# Altium schematic sheet Ports and Power.SchDoc
size 420 x 297 mm; SheetNumber: 7; SheetTotal: 7
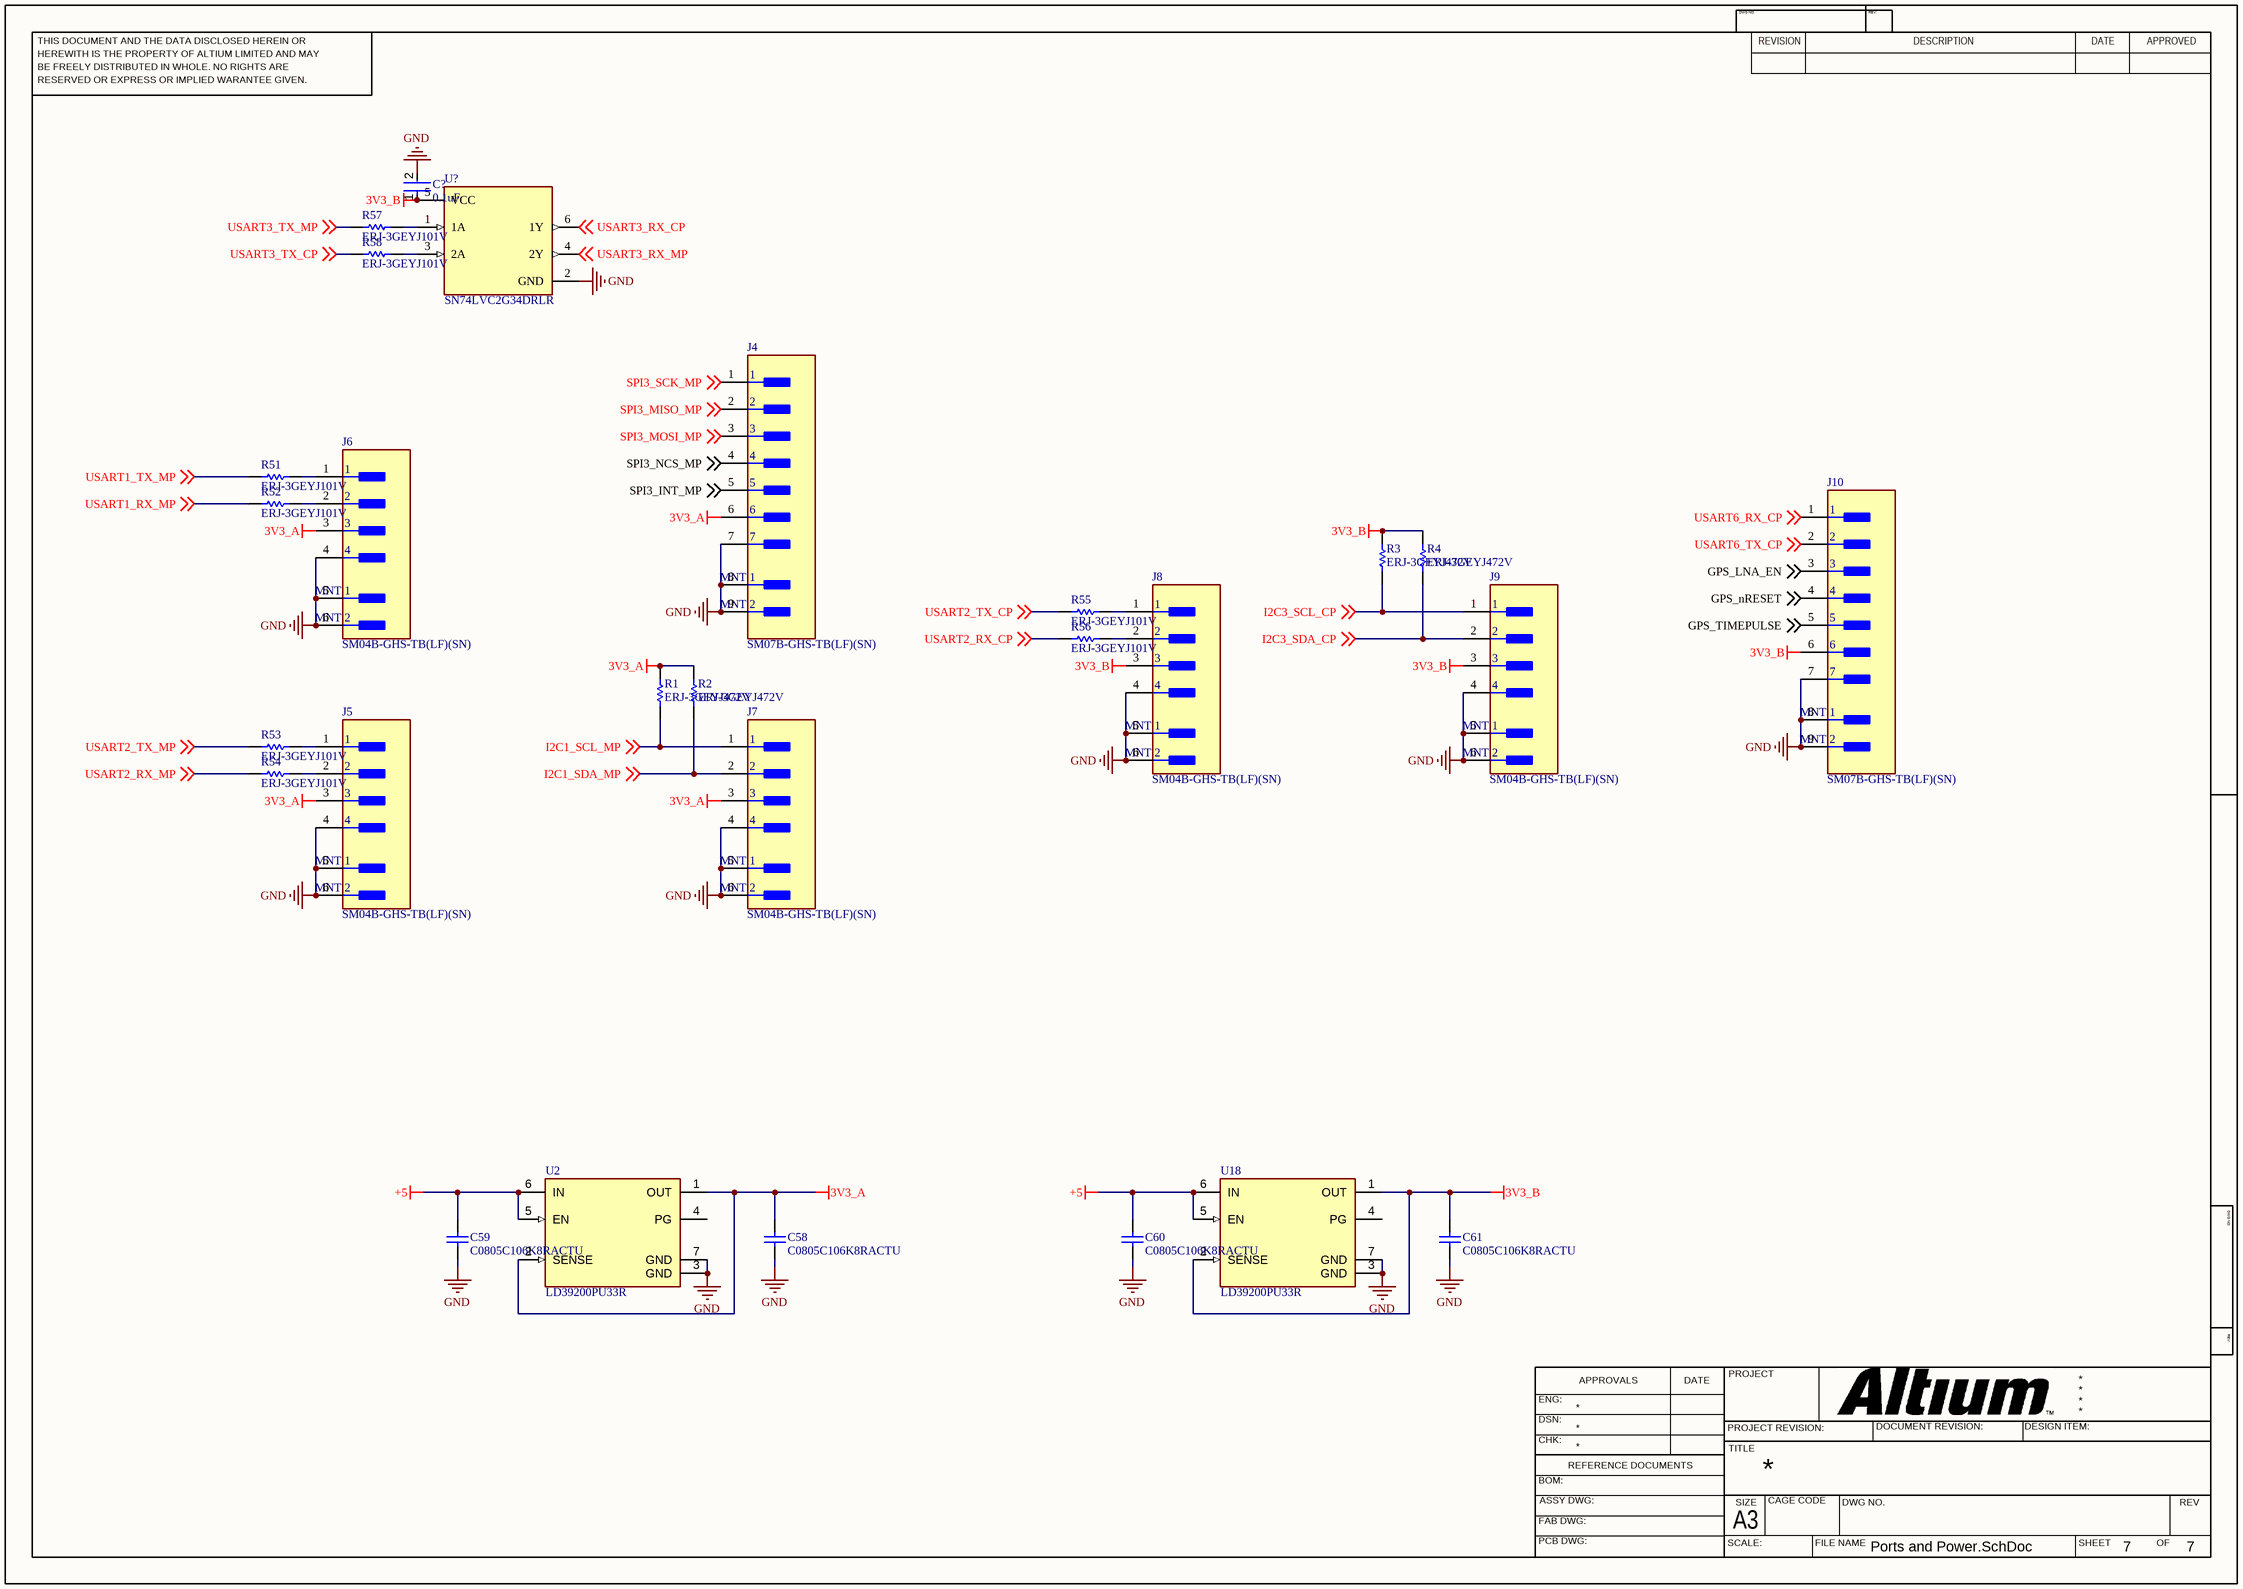
[diagram p0: Ports and Power.SchDoc]

## Parts
C58  C0805C106K8RACTU  [CAPC2013X145X50LL20T25]
C59  C0805C106K8RACTU  [CAPC2013X145X50LL20T25]
C60  C0805C106K8RACTU  [CAPC2013X145X50LL20T25]
C61  C0805C106K8RACTU  [CAPC2013X145X50LL20T25]
C?  0.1uF  [FP-C0603C-CF-MFG]
J4  SM07B-GHS-TB(LF)(SN)  [FP-SM07B-GHS-TB_LF_SN-MFG]
J5  SM04B-GHS-TB(LF)(SN)  [FP-SM04B-GHS-TB_LF_SN-MFG]
J6  SM04B-GHS-TB(LF)(SN)  [FP-SM04B-GHS-TB_LF_SN-MFG]
J7  SM04B-GHS-TB(LF)(SN)  [FP-SM04B-GHS-TB_LF_SN-MFG]
J8  SM04B-GHS-TB(LF)(SN)  [FP-SM04B-GHS-TB_LF_SN-MFG]
J9  SM04B-GHS-TB(LF)(SN)  [FP-SM04B-GHS-TB_LF_SN-MFG]
J10  SM07B-GHS-TB(LF)(SN)  [FP-SM07B-GHS-TB_LF_SN-MFG]
R1  ERJ-3GEYJ472V  [RESC1608X55X30LL15T15]
R2  ERJ-3GEYJ472V  [RESC1608X55X30LL15T15]
R3  ERJ-3GEYJ472V  [RESC1608X55X30LL15T15]
R4  ERJ-3GEYJ472V  [RESC1608X55X30LL15T15]
R51  ERJ-3GEYJ101V  [RESC1608X55X30LL15T15]
R52  ERJ-3GEYJ101V  [RESC1608X55X30LL15T15]
R53  ERJ-3GEYJ101V  [RESC1608X55X30LL15T15]
R54  ERJ-3GEYJ101V  [RESC1608X55X30LL15T15]
R55  ERJ-3GEYJ101V  [RESC1608X55X30LL15T15]
R56  ERJ-3GEYJ101V  [RESC1608X55X30LL15T15]
R57  ERJ-3GEYJ101V  [RESC1608X55X30LL15T15]
R58  ERJ-3GEYJ101V  [RESC1608X55X30LL15T15]
U2  LD39200PU33R  [FP-DFN6-7946637-MFG]
U18  LD39200PU33R  [FP-DFN6-7946637-MFG]
U?  SN74LVC2G34DRLR  [FP-DRL0006A-MFG]

## Nets
3V3_A: C58.1 J4.6 J5.3 J6.3 J7.3 R1.2 R2.1 U2.1(OUT) U2.2(SENSE)
3V3_B: C61.1 C?.1 J8.3 J9.3 J10.6 R3.2 R4.2 U18.1(OUT) U18.2(SENSE) U?.5(VCC)
+5: C59.1 C60.1 U2.5(EN) U2.6(IN) U18.5(EN) U18.6(IN)
GND: C58.2 C59.2 C60.2 C61.2 C?.2 J4.7 J4.8(MNT_1) J4.9(MNT_2) J5.4 J5.5(MNT_1) J5.6(MNT_2) J6.4 J6.5(MNT_1) J6.6(MNT_2) J7.4 J7.5(MNT_1) J7.6(MNT_2) J8.4 J8.5(MNT_1) J8.6(MNT_2) J9.4 J9.5(MNT_1) J9.6(MNT_2) J10.7 J10.8(MNT_1) J10.9(MNT_2) U2.3(GND) U2.7(GND) U18.3(GND) U18.7(GND) U?.2(GND)
GPS_LNA_EN: J10.3 ; off-sheet GPS_LNA_EN
GPS_nRESET: J10.4 ; off-sheet GPS_nRESET
GPS_TIMEPULSE: J10.5 ; off-sheet GPS_TIMEPULSE
I2C1_SCL_MP: J7.1 R1.1 ; off-sheet I2C1_SCL_MP
I2C1_SDA_MP: J7.2 R2.2 ; off-sheet I2C1_SDA_MP
I2C3_SCL_CP: J9.1 R3.1 ; off-sheet I2C3_SCL_CP
I2C3_SDA_CP: J9.2 R4.1 ; off-sheet I2C3_SDA_CP
SPI3_INT_MP: J4.5 ; off-sheet SPI3_INT_MP
SPI3_MISO_MP: J4.2 ; off-sheet SPI3_MISO_MP
SPI3_MOSI_MP: J4.3 ; off-sheet SPI3_MOSI_MP
SPI3_NCS_MP: J4.4 ; off-sheet SPI3_NCS_MP
SPI3_SCK_MP: J4.1 ; off-sheet SPI3_SCK_MP
USART1_RX_MP: R52.1 ; off-sheet USART1_RX_MP
USART1_TX_MP: R51.1 ; off-sheet USART1_TX_MP
USART2_RX_CP: R56.1 ; off-sheet USART2_RX_CP
USART2_RX_MP: R54.1 ; off-sheet USART2_RX_MP
USART2_TX_CP: R55.1 ; off-sheet USART2_TX_CP
USART2_TX_MP: R53.1 ; off-sheet USART2_TX_MP
USART3_RX_CP: U?.6(1Y) ; off-sheet USART3_RX_CP
USART3_RX_MP: U?.4(2Y) ; off-sheet USART3_RX_MP
USART3_TX_CP: R58.1 ; off-sheet USART3_TX_CP
USART3_TX_MP: R57.1 ; off-sheet USART3_TX_MP
USART6_RX_CP: J10.1 ; off-sheet USART6_RX_CP
USART6_TX_CP: J10.2 ; off-sheet USART6_TX_CP
NetJ5_1: J5.1 R53.2
NetJ5_2: J5.2 R54.2
NetJ6_1: J6.1 R51.2
NetJ6_2: J6.2 R52.2
NetJ8_1: J8.1 R55.2
NetJ8_2: J8.2 R56.2
NetR57_2: R57.2 U?.1(1A)
NetR58_2: R58.2 U?.3(2A)

Not connected (* = marked no-connect by the designer): U2 4(PG); U18 4(PG)

## Notes on the sheet
- THIS DOCUMENT AND THE DATA DISCLOSED HEREIN OR
- HEREWITH IS THE PROPERTY OF ALTIUM LIMITED AND MAY
- DWG NO:
- REVISION
- REV:
- DESCRIPTION
- DATE
- APPROVED
- BE FREELY DISTRIBUTED IN WHOLE. NO RIGHTS ARE
- RESERVED OR EXPRESS OR IMPLIED WARANTEE GIVEN.
- ENG:
- APPROVALS
- PROJECT
- DSN:
- CHK:
- REFERENCE DOCUMENTS
- PROJECT REVISION:
- TITLE
- DOCUMENT REVISION:
- DESIGN ITEM:
- BOM:
- FAB DWG:
- PCB DWG:
- ASSY DWG:
- SCALE:
- A3
- SIZE
- CAGE CODE
- FILE NAME
- DWG NO.
- SHEET
- OF
- REV

## Library data of the parts
C58-C61 = CMP-2007-01044-1: Manufacturer: Kemet; Part Number: C0805C106K8RACTU
C? = CMP-2006-03061-2: CAP CER 0.1UF 50V X7R 0603; Manufacturer: KEMET; Manufacturer Part Number: C0603C104K5RACTU; Tolerance: 0.1; Temperature Coefficient: 30ppm/°C; Material: Ceramic; Automotive Grade: Grade 1; Value: 0.10 μF; Temperature: -55°C to +125°C; RoHS: TRUE; Temperature Range High: +125°C; Lead Free: Yes; Octopart: https://octopart.com/c0603c104k5ractu-kemet-139244; Digikey Description: CAP CER 0.1UF 50V X7R 0603; Category: Cap; Package: C0603C-CF; ComponentLink2Description: Datasheet; Temperature Range Low: -55°C; Device Class L1: Passive Components; Voltage Rating: 50 V; Automotive: Yes; Device Class L3: Ceramic Capacitors; ComponentLink2URL: https://api.kemet.com/component-edge/download/datasheet/C0603C100J5GACAUTO.pdf; Capacitance: 0.10 μF; Device Class L2: Capacitors; Temperature Characteristic: X7R; Height: 0.87mm
J4 J10 = CMP-17439-000109-1: CONN HEADER SMD R/A 7POS 1.25MM; Number of Contacts: 7; Wire/Cable Gauge: 26AWG; Voltage Rating (AC): 50V; Pitch: 0.049inch; Current Rating: 1A; Connector Type: Header; Contact Shape: Rectangular; Min Operating Temperature: -25°C; Number of Positions: 7; Contact Material: Bronze; Packaging: Cut Tape; Insulation Material: Nylon; Max Operating Temperature: 85°C; Package Quantity: 2500; Series: GH; Contact Finish - Mating: TIN; Voltage Rating: 50V; Color: Natural; Mount: Surface Mount; Contact Plating: Tin; Termination: Solder; Lead Free: Lead Free; Contact Type: Outer Shroud Contact; Fastening Type: Ramp; Number of Rows: 1; Housing Material: Nylon; Flammability Rating: UL94 V-0; Housing Color: Natural; Insulation Color: Natural
J5-J9 = CMP-17439-000411-1: CONN HEADER SMD R/A 4POS 1.25MM; Voltage Rating: 50V; Number of Contacts: 4; Current Rating: 1A; Termination: Solder; Mount: Surface Mount; REACH SVHC: No SVHC; Packaging: Cut Tape; Contact Material: Bronze; Series: GH; Orientation: Right Angle; Lead Free: Lead Free; Housing Material: Nylon; Contact Plating: Tin; Housing Color: Natural; Number of Rows: 1; Pitch: 1.25mm; Number of Positions: 4
R1-R4 = CMP-2000-00796-1: Manufacturer: Panasonic; Part Number: ERJ-3GEYJ472V
R51-R58 = CMP-2000-00702-1: Manufacturer: Panasonic; Part Number: ERJ-3GEYJ101V
U2 U18 = CMP-12153-000011-1: IC REG LINEAR 3.3V 2A 6DFN; Number of Outputs: 1; Max Input Voltage: 6V; Output Type: Fixed; Min Input Voltage: 1.25V; Dropout Voltage: 130mV; Operating Supply Current: 1mA; Number of Regulators: 1; Case/Package: DFN; Packaging: Tape and Reel; Output Current: 2A; Min Operating Temperature: -40°C; Mount: Surface Mount; Output Voltage: 3.3V; Max Operating Temperature: 125°C; Lead Free: Lead Free; Package Quantity: 3000
U? = CMP-0859-00812-4: IC BUFFER NON-INVERT 5.5V 6SOT; Number of Bits per Element: 1; Number of Bits: 2; Low Level Output Current: 32mA; Polarity: Non-Inverting; Min Supply Voltage: 1.65V; Propagation Delay: 8.6ns; High Level Output Current: -32mA; Quiescent Current: 10uA; Contact Plating: Gold; Case/Package: SOT; Technology: CMOS; Min Operating Temperature: -40°C; Number of Elements: 2; REACH SVHC: No SVHC; Number of Channels: 2; Series: 74LVC; Number of Pins: 6; Mount: Surface Mount; Logic Function: Buffer; Number of Output Lines: 2; Packaging: Tape and Reel; Package Quantity: 4000; Radiation Hardening: No; Number of Gates: 2; Turn-On Delay Time: 8.6ns; Max Operating Temperature: 125°C; Max Supply Voltage: 5.5V; Lead Free: Lead Free; RoHS Compliant: Yes; Number of Outputs: 2; Number of Inputs: 2; Number of Input Lines: 2